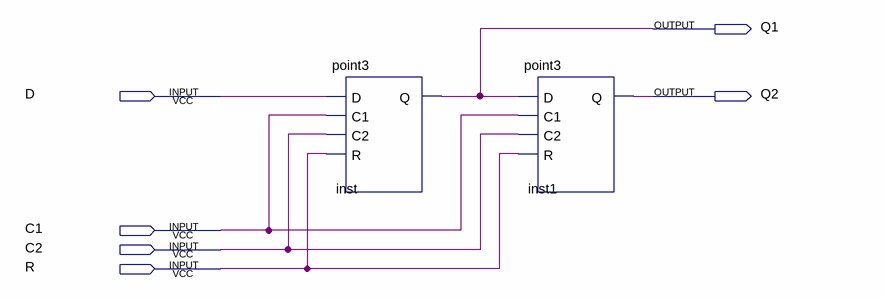
[diagram p0: schematic sheet]
// Quartus schematic point4.bdf as structural Verilog: 2 symbols, 6 pins
module point4 (
  input  D,
  input  C1,
  input  C2,
  input  R,
  output Q1,
  output Q2
);

  point3 inst (.D(D), .C1(C1), .C2(C2), .R(R), .Q(Q1));
  point3 inst1 (.D(Q1), .C1(C1), .C2(C2), .R(R), .Q(Q2));
endmodule
